# EAGLE design power-E01 (EAGLE 7.3.0)
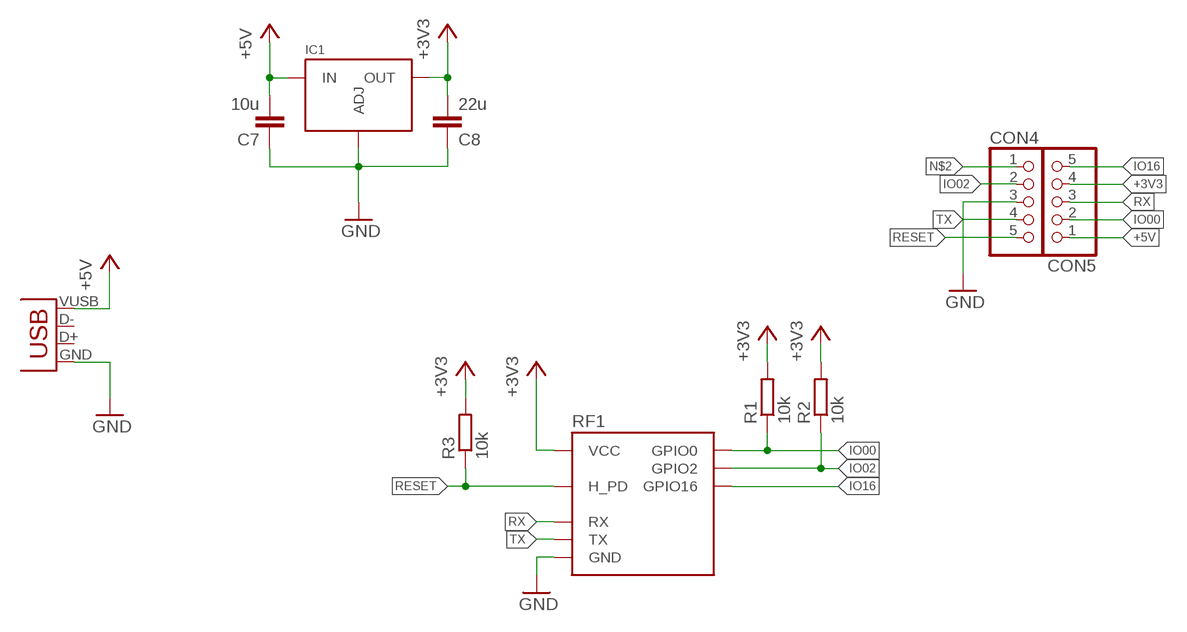
[diagram p0: schematic, sheet 1]

## Parts
C7  10u  C-EUC0805  [C0805]
C8  22u  C-EUC0805  [C0805]
CON1  USBMICRO-NO_CENTER  [USB-MICRO-SMD-NO_CENTER]
CON4  GENERIC-1X5  [PINHEADER-100MIL-1X5-NOSILK]
CON5  GENERIC-1X5  [PINHEADER-100MIL-1X5-NOSILK]
IC1  REGULATOR-LM317-SOT223  [SOT223]
R1  10k  R-EU_R0603  [R0603]
R2  10k  R-EU_R0603  [R0603]
R3  10k  R-EU_R0603  [R0603]
RF1  ESP2866-ESP-01THT-NOSILK  [ESP8266-ESP-01-NOSILK]

## Nets
+3V3: C8.2 CON5.4 IC1.2(OUT) IC1.4(OUT) R1.2 R2.2 R3.2 RF1.VCC
+5V: C7.2 CON1.VUSB(VBUS) CON5.1 IC1.3(IN)
GND: C7.1 C8.1 CON1.GND CON4.3 IC1.1(ADJ) RF1.GND
IO00: CON5.2 R1.1 RF1.GPIO0
IO02: CON4.2 R2.1 RF1.GPIO2
IO16: CON5.5 RF1.GPIO16
N$2: CON4.1
RESET: CON4.5 R3.1 RF1.H_PD
RX: CON5.3 RF1.RX
TX: CON4.4 RF1.TX
Unconnected: CON1.D+ CON1.D-

## Library data of the parts
C7 C8 = p.peter-rcl:C-EU: CAPACITOR, European symbol
CON1 = p.peter-connectors:USB
CON4 CON5 = p.peter-connectors:GENERIC-1X5
IC1 = p.peter-regulators:REGULATOR-LM317
R1-R3 = p.peter-rcl:R-EU_: RESISTOR, European symbol
RF1 = p.peter-periphery:ESP2866-ESP-01

## Board
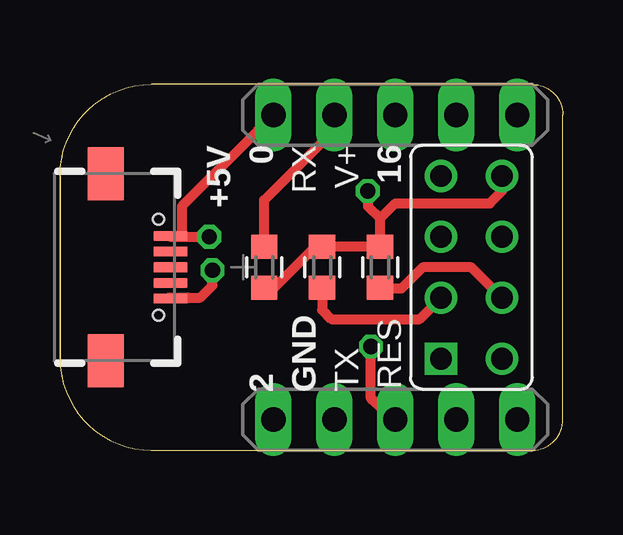
[diagram p1: board, top side]
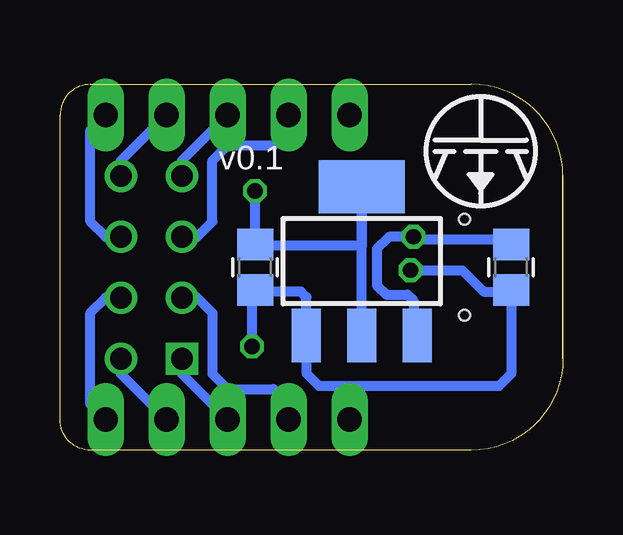
[diagram p2: board, bottom side, seen from below]

Size 20.95 x 15.24 mm. Coordinates in mm from the lower left corner, seen from the top.
Outline: 0,3.81 0,7.62 0,11.43
Outline: 0,11.43 arc-90 3.81,15.24 19.68,15.24 arc-90 20.95,13.97 20.95,1.27 arc-90 19.68,0 3.81,0 arc-90 0,3.81
Outline: 0,11.43 0,3.81
Copper layers (1*16): Top 0.0356mm / dielectric 1.5011mm / Bottom 0.0356mm
Design rules "oshpark": minimum track width 6mil, minimum drill 13mil, track to track 6mil, track to pad 6mil, pad to pad 6mil, via to via 6mil, smd to smd 6mil, copper to edge 15mil, drill to drill 6mil, minimum pad ring 7mil, minimum via ring 7mil, stop-mask expansion 4mil, vias tented up to drill 4.1mm, thermal gap 10mil

### Footprints (pad centres in the part's own frame; a part is rotated, then mirrored left to right if it is on the bottom)
C0805 = smd 1.3 x 1.5: 1 -0.95,0; 2 0.95,0
USB-MICRO-SMD-NO_CENTER = smd 1.4 x 0.4: D+ 1.43,0; D- 1.43,0.65; GND 1.43,-1.3; ID 1.43,-0.65; VUSB 1.43,1.3 | smd 1.5 x 2.2: P$1 -1.27,3.9; P$2 -1.27,-3.9 | hole 0.45: 0.93,2; 0.93,-2
PINHEADER-100MIL-1X5-NOSILK = drill 1.016 long: 1 -5.08,0; 2 -2.54,0; 3 0,0; 4 2.54,0; 5 5.08,0
SOT223 = smd 1.219 x 2.235: 1 -2.311,-3.099; 2 0,-3.099; 3 2.311,-3.099 | smd 3.6 x 2.2: 4 0,3.099
R0603 = smd 1 x 1.1: 1 -0.85,0; 2 0.85,0
ESP8266-ESP-01-NOSILK = drill 0.9 square: GND 1.27,3.81 | drill 0.9: GPIO0 1.27,-1.27; GPIO2 1.27,1.27; GPIO16 -1.27,-1.27; H_PD -1.27,1.27; RX 1.27,-3.81; TX -1.27,3.81; VCC -1.27,-3.81

### Placement (x,y rotation side)
C7  2.16,7.62 90 bottom
C8  12.83,7.62 90 bottom
CON1  3.17,7.62 0 top
CON4  13.97,1.27 0 top
CON5  13.97,13.97 0 top
IC1  8.38,7.87 0 bottom
R1  8.51,7.62 270 top
R2  10.92,7.62 90 top
R3  13.34,7.62 90 top
RF1  17.14,7.62 180 top
U$3  [LOGO-JUSTGEEK-XS]  3.43,12.45 0 bottom

### Tracks (layer width: path | path; a pad name or v marks a point on that pad's centre or on a via)
+3V3  (via drill 0.64)
  Top 0.406: 13.34,9.65 R3.2 R2.2 10.63,8.47 10.03,7.87 9.78,7.62 8.93,6.77 R1.2 | 13.34,9.65 13.97,10.29 17.91,10.29 18.41,10.79 18.41,11.18 RF1.VCC | v12.83,10.79 12.83,10.16 13.34,9.65
  Bottom 0.305: 7.28,11.01 IC1.4
  Bottom 0.406: RF1.VCC 18.41,12.06 CON5.4 | IC1.2 8.38,5.59 8.38,8.51 | 8.38,8.51 IC1.4 8.38,8.51 | C8.2 12.83,8.64 | 8.38,8.51 12.77,8.51 C8.2 | C8.2 v12.83,10.79
+5V  (via drill 0.64)
  Top 0.406: 4.63,8.89 CON1.VUSB | CON5.1 8.26,13.34 5.08,10.16 5.08,8.89 | 4.63,8.89 5.08,8.89 | 5.08,8.89 v6.22,8.89 | 4.63,8.89 5.08,8.89
  Bottom 0.406: 6,4.7 IC1.3 6.22,4.93 6.22,6.22 6.48,6.48 7.37,6.48 7.75,6.86 7.75,8.38 7.24,8.89 v6.22,8.89 6.1,8.76 2.54,8.76 2.22,8.57 C7.2
GND  (via drill 0.64)
  Top 0.406: CON4.3 12.95,2.16 v12.95,4.32 | CON1.GND 4.57,6.35 5.33,6.35 5.84,6.35 6.35,6.86 v6.35,7.49
  Bottom 0.406: RF1.GND 15.88,3.17 CON4.3 | 12.45,6.73 12.7,6.48 12.76,6.54 12.76,6.6 | 12.76,6.6 10.92,6.6 10.69,6.38 IC1.1 10.67,4.75 10.67,3.17 10.16,2.67 2.67,2.67 2.16,3.17 C7.1 2.23,6.6 3.3,6.6 4.19,7.49 v6.35,7.49 | 12.76,6.6 C8.1 12.95,6.54 v12.95,4.32
IO00
  Top 0.406: CON5.2 11.43,13.34 8.51,10.41 R1.1
  Bottom 0.406: RF1.GPIO0 15.24,8.89 14.61,9.53 14.61,12.06 13.97,12.7 12.06,12.7 11.43,13.34 CON5.2
IO02
  Top 0.406: R2.1 10.92,6.73 10.92,5.84 11.3,5.46 14.99,5.46 RF1.GPIO2
  Bottom 0.406: RF1.GPIO2 15.24,6.35 14.61,5.71 14.61,3.17 13.97,2.54 12.06,2.54 11.43,1.91 CON4.2
IO16
  Bottom 0.406: RF1.GPIO16 19.05,8.89 19.68,9.53 19.68,13.34 CON5.5
RESET
  Top 0.406: RF1.H_PD 17.14,7.62 15.11,7.62 14.22,6.73 13.37,6.73 R3.1
  Bottom 0.406: CON4.5 19.68,1.91 19.68,5.71 19.05,6.35 RF1.H_PD
RX
  Bottom 0.406: RF1.RX 15.88,12.06 CON5.3
TX
  Bottom 0.406: RF1.TX 18.41,3.17 CON4.4

### Text on the board
tPlace: +5V | 0 | RX | V+ | 16 | RES | 2 | GND | TX
bPlace: v0.1